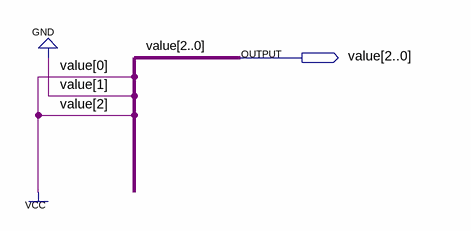
[diagram p0: schematic sheet]
// Quartus schematic dec_5_3bit.bdf as structural Verilog: 0 symbols, 1 pins
module dec_5_3bit (
  output [2:0] value
);


  assign value = 3'b101;
endmodule
